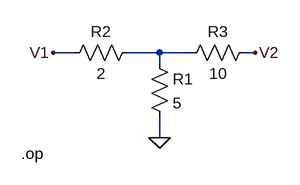
[diagram p0: schematic ejemplo6.asc]
ejemplo6.asc, the LTspice schematic file:
Version 4
SHEET 1 880 680
WIRE 64 144 32 144
WIRE 192 144 144 144
WIRE 240 144 192 144
WIRE 336 144 320 144
WIRE 192 160 192 144
WIRE 192 272 192 240
FLAG 192 272 0
FLAG 336 144 V2
FLAG 32 144 V1
SYMBOL res 176 144 R0
SYMATTR InstName R1
SYMATTR Value 5
SYMBOL res 160 128 R90
WINDOW 0 0 56 VBottom 2
WINDOW 3 32 56 VTop 2
SYMATTR InstName R2
SYMATTR Value 2
SYMBOL res 336 128 R90
WINDOW 0 0 56 VBottom 2
WINDOW 3 32 56 VTop 2
SYMATTR InstName R3
SYMATTR Value 10
TEXT -16 296 Left 2 !.op

The netlist it stands for:
* ejemplo6.asc
R1 N001 0 5
R2 N001 V1 2
R3 V2 N001 10
.op
.backanno
.end